# Altium schematic sheet QCopterMV_MAIN_Sch.SchDoc: QCopterMV-MAIN
size 203 x 228 mm; Author: Hom; CompanyName: KitSprout; DrawnBy: Hom; Engineer: Hom; Organization: KitSprout; Revision: A; SheetNumber: 1; SheetTotal: 1; License: CC BY-SA 4.0; Version: 2.0; LibVersion: 2.7; PageSetup: Record=PageOptions|CenterHorizontal=True|CenterVertical=True|PrintScale=1.00|XCorrection=1.00|YCorrection=1.00|PrintKind=0|BorderSize=5000000|LeftOffset=0|BottomOffset=0|Orientation=2|PaperLength=1000|PaperWidth=1000|Scale=100|PaperSource=7|PrintQuality=-4|MediaType=1|DitherType=10|PaperKind=A4|PrintScaleMode=0
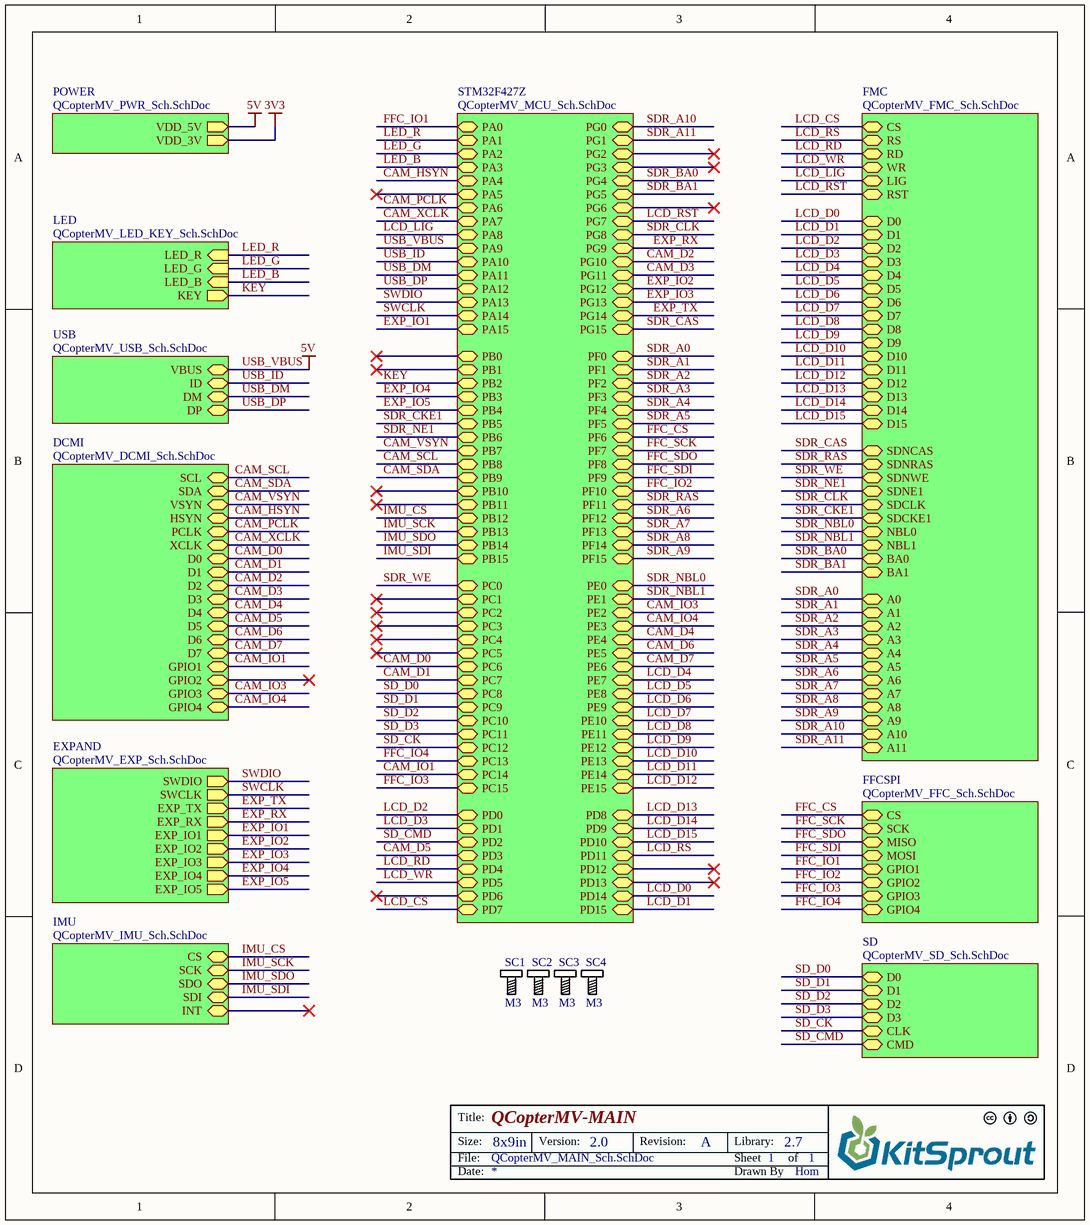
[diagram p0: QCopterMV_MAIN_Sch.SchDoc]

## Parts
SC1  M3  [SCRREW_M3]
SC2  M3  [SCRREW_M3]
SC3  M3  [SCRREW_M3]
SC4  M3  [SCRREW_M3]

## Sub-sheets
DCMI = QCopterMV_DCMI_Sch.SchDoc: SCL, SDA, VSYN, HSYN, PCLK, XCLK, D0, D1, D2, D3, D4, D5, D6, D7, GPIO1, GPIO2, GPIO3, GPIO4
EXPAND = QCopterMV_EXP_Sch.SchDoc: SWDIO (out), SWCLK (out), EXP_TX (out), EXP_RX (out), EXP_IO1 (out), EXP_IO2 (out), EXP_IO3 (out), EXP_IO4 (out), EXP_IO5 (out)
FFCSPI = QCopterMV_FFC_Sch.SchDoc: MISO, CS, MOSI, SCK, GPIO1, GPIO2, GPIO3, GPIO4
FMC = QCopterMV_FMC_Sch.SchDoc: D0, D1, D2, D3, D4, D5, D6, D7, D8, D9, D10, D11, D12, D13, D14, D15, RD, WR, CS, RS, LIG, RST, NBL0, NBL1, BA1, BA0, SDNRAS, SDNCAS, SDNWE, SDNE1, SDCLK, SDCKE1, A0, A1, A2, A3, A4, A5, A6, A7, A8, A9, A10, A11
IMU = QCopterMV_IMU_Sch.SchDoc: SDO, SCK, SDI, CS, INT
LED = QCopterMV_LED_KEY_Sch.SchDoc: LED_R (in), LED_G (in), LED_B (in), KEY (out)
POWER = QCopterMV_PWR_Sch.SchDoc: VDD_3V (out), VDD_5V (out)
SD = QCopterMV_SD_Sch.SchDoc: D0, CMD, D1, D2, D3, CLK
STM32F427Z = QCopterMV_MCU_Sch.SchDoc: PA0, PA1, PA2, PA3, PA4, PA5, PA6, PA7, PA8, PA9, PA10, PA11, PA12, PA13, PA14, PA15, PB0, PB1, PB2, PB3, PB4, PB5, PB6, PB7, PB8, PB9, PB10, PB12, PB13, PB14, PB15, PC0, PC1, PC2, PC3, PC5, PC6, PC7, PC8, PC9, PC10, PC11, PC12, PC13, PC14, PB11, PD0, PC4, PC15, PD1, PD2, PD3, PD4, PD5, PD6, PD7, PD8, PD9, PD10, PD11, PD12, PD13, PD14, PD15, PE0, PF0, PG0, PG1, PG2, PG3, PG4, PG5, PG6, PG7, PG8, PG9, PG10, PG11, PG12, PG13, PG14, PG15, PF1, PF2, PF3, PF4, PF5, PF6, PF7, PF8, PF9, PF10, PF11, PF12, PF13, PF14, PF15, PE1, PE2, PE3, PE4, PE5, PE6, PE7, PE8, PE9, PE10, PE11, PE12, PE13, PE14, PE15
USB = QCopterMV_USB_Sch.SchDoc: VBUS, ID, DM, DP

## Nets
3V3: sheet POWER/VDD_3V
USB_VBUS: sheet STM32F427Z/PA9, sheet POWER/VDD_5V, sheet USB/VBUS  [also labelled 5V]
CAM_D0: sheet STM32F427Z/PC6, sheet DCMI/D0
CAM_D1: sheet STM32F427Z/PC7, sheet DCMI/D1
CAM_D2: sheet STM32F427Z/PG10, sheet DCMI/D2
CAM_D3: sheet STM32F427Z/PG11, sheet DCMI/D3
CAM_D4: sheet STM32F427Z/PE4, sheet DCMI/D4
CAM_D5: sheet STM32F427Z/PD3, sheet DCMI/D5
CAM_D6: sheet STM32F427Z/PE5, sheet DCMI/D6
CAM_D7: sheet STM32F427Z/PE6, sheet DCMI/D7
CAM_HSYN: sheet STM32F427Z/PA4, sheet DCMI/HSYN
CAM_IO1: sheet STM32F427Z/PC14, sheet DCMI/GPIO1
CAM_IO3: sheet STM32F427Z/PE2, sheet DCMI/GPIO3
CAM_IO4: sheet STM32F427Z/PE3, sheet DCMI/GPIO4
CAM_PCLK: sheet STM32F427Z/PA6, sheet DCMI/PCLK
CAM_SCL: sheet STM32F427Z/PB8, sheet DCMI/SCL
CAM_SDA: sheet STM32F427Z/PB9, sheet DCMI/SDA
CAM_VSYN: sheet STM32F427Z/PB7, sheet DCMI/VSYN
CAM_XCLK: sheet STM32F427Z/PA7, sheet DCMI/XCLK
EXP_IO1: sheet STM32F427Z/PA15, sheet EXPAND/EXP_IO1
EXP_IO2: sheet STM32F427Z/PG12, sheet EXPAND/EXP_IO2
EXP_IO3: sheet STM32F427Z/PG13, sheet EXPAND/EXP_IO3
EXP_IO4: sheet STM32F427Z/PB3, sheet EXPAND/EXP_IO4
EXP_IO5: sheet STM32F427Z/PB4, sheet EXPAND/EXP_IO5
EXP_RX: sheet STM32F427Z/PG9, sheet EXPAND/EXP_RX
EXP_TX: sheet STM32F427Z/PG14, sheet EXPAND/EXP_TX
FFC_CS: sheet STM32F427Z/PF6, sheet FFCSPI/CS
FFC_IO1: sheet STM32F427Z/PA0, sheet FFCSPI/GPIO1
FFC_IO2: sheet STM32F427Z/PF10, sheet FFCSPI/GPIO2
FFC_IO3: sheet STM32F427Z/PC15, sheet FFCSPI/GPIO3
FFC_IO4: sheet STM32F427Z/PC13, sheet FFCSPI/GPIO4
FFC_SCK: sheet STM32F427Z/PF7, sheet FFCSPI/SCK
FFC_SDI: sheet STM32F427Z/PF9, sheet FFCSPI/MOSI
FFC_SDO: sheet STM32F427Z/PF8, sheet FFCSPI/MISO
IMU_CS: sheet STM32F427Z/PB12, sheet IMU/CS
IMU_SCK: sheet STM32F427Z/PB13, sheet IMU/SCK
IMU_SDI: sheet STM32F427Z/PB15, sheet IMU/SDI
IMU_SDO: sheet STM32F427Z/PB14, sheet IMU/SDO
KEY: sheet STM32F427Z/PB2, sheet LED/KEY
LCD_CS: sheet STM32F427Z/PD7, sheet FMC/CS
LCD_D0: sheet STM32F427Z/PD14, sheet FMC/D0
LCD_D1: sheet STM32F427Z/PD15, sheet FMC/D1
LCD_D2: sheet STM32F427Z/PD0, sheet FMC/D2
LCD_D3: sheet STM32F427Z/PD1, sheet FMC/D3
LCD_D4: sheet STM32F427Z/PE7, sheet FMC/D4
LCD_D5: sheet STM32F427Z/PE8, sheet FMC/D5
LCD_D6: sheet STM32F427Z/PE9, sheet FMC/D6
LCD_D7: sheet STM32F427Z/PE10, sheet FMC/D7
LCD_D8: sheet STM32F427Z/PE11, sheet FMC/D8
LCD_D9: sheet STM32F427Z/PE12, sheet FMC/D9
LCD_D10: sheet STM32F427Z/PE13, sheet FMC/D10
LCD_D11: sheet STM32F427Z/PE14, sheet FMC/D11
LCD_D12: sheet STM32F427Z/PE15, sheet FMC/D12
LCD_D13: sheet STM32F427Z/PD8, sheet FMC/D13
LCD_D14: sheet STM32F427Z/PD9, sheet FMC/D14
LCD_D15: sheet STM32F427Z/PD10, sheet FMC/D15
LCD_LIG: sheet STM32F427Z/PA8, sheet FMC/LIG
LCD_RD: sheet STM32F427Z/PD4, sheet FMC/RD
LCD_RS: sheet STM32F427Z/PD11, sheet FMC/RS
LCD_RST: sheet STM32F427Z/PG7, sheet FMC/RST
LCD_WR: sheet STM32F427Z/PD5, sheet FMC/WR
LED_B: sheet STM32F427Z/PA3, sheet LED/LED_B
LED_G: sheet STM32F427Z/PA2, sheet LED/LED_G
LED_R: sheet STM32F427Z/PA1, sheet LED/LED_R
SD_CK: sheet STM32F427Z/PC12, sheet SD/CLK
SD_CMD: sheet STM32F427Z/PD2, sheet SD/CMD
SD_D0: sheet STM32F427Z/PC8, sheet SD/D0
SD_D1: sheet STM32F427Z/PC9, sheet SD/D1
SD_D2: sheet STM32F427Z/PC10, sheet SD/D2
SD_D3: sheet STM32F427Z/PC11, sheet SD/D3
SDR_A0: sheet STM32F427Z/PF0, sheet FMC/A0
SDR_A1: sheet STM32F427Z/PF1, sheet FMC/A1
SDR_A2: sheet STM32F427Z/PF2, sheet FMC/A2
SDR_A3: sheet STM32F427Z/PF3, sheet FMC/A3
SDR_A4: sheet STM32F427Z/PF4, sheet FMC/A4
SDR_A5: sheet STM32F427Z/PF5, sheet FMC/A5
SDR_A6: sheet STM32F427Z/PF12, sheet FMC/A6
SDR_A7: sheet STM32F427Z/PF13, sheet FMC/A7
SDR_A8: sheet STM32F427Z/PF14, sheet FMC/A8
SDR_A9: sheet STM32F427Z/PF15, sheet FMC/A9
SDR_A10: sheet STM32F427Z/PG0, sheet FMC/A10
SDR_A11: sheet STM32F427Z/PG1, sheet FMC/A11
SDR_BA0: sheet STM32F427Z/PG4, sheet FMC/BA0
SDR_BA1: sheet STM32F427Z/PG5, sheet FMC/BA1
SDR_CAS: sheet STM32F427Z/PG15, sheet FMC/SDNCAS
SDR_CKE1: sheet STM32F427Z/PB5, sheet FMC/SDCKE1
SDR_CLK: sheet STM32F427Z/PG8, sheet FMC/SDCLK
SDR_NBL0: sheet STM32F427Z/PE0, sheet FMC/NBL0
SDR_NBL1: sheet STM32F427Z/PE1, sheet FMC/NBL1
SDR_NE1: sheet STM32F427Z/PB6, sheet FMC/SDNE1
SDR_RAS: sheet STM32F427Z/PF11, sheet FMC/SDNRAS
SDR_WE: sheet STM32F427Z/PC0, sheet FMC/SDNWE
SWCLK: sheet STM32F427Z/PA14, sheet EXPAND/SWCLK
SWDIO: sheet STM32F427Z/PA13, sheet EXPAND/SWDIO
USB_DM: sheet STM32F427Z/PA11, sheet USB/DM
USB_DP: sheet STM32F427Z/PA12, sheet USB/DP
USB_ID: sheet STM32F427Z/PA10, sheet USB/ID

## Notes on the sheet
- Title:
- Size:
- Date:
- File:
- 8x9in
- Version:
- Revision:
- Sheet
- Drawn By
- Library:
- of

## Library data of the parts
SC1-SC4 = Screw_M3: Screw